# Altium project RFFE_Controller.PrjPcb
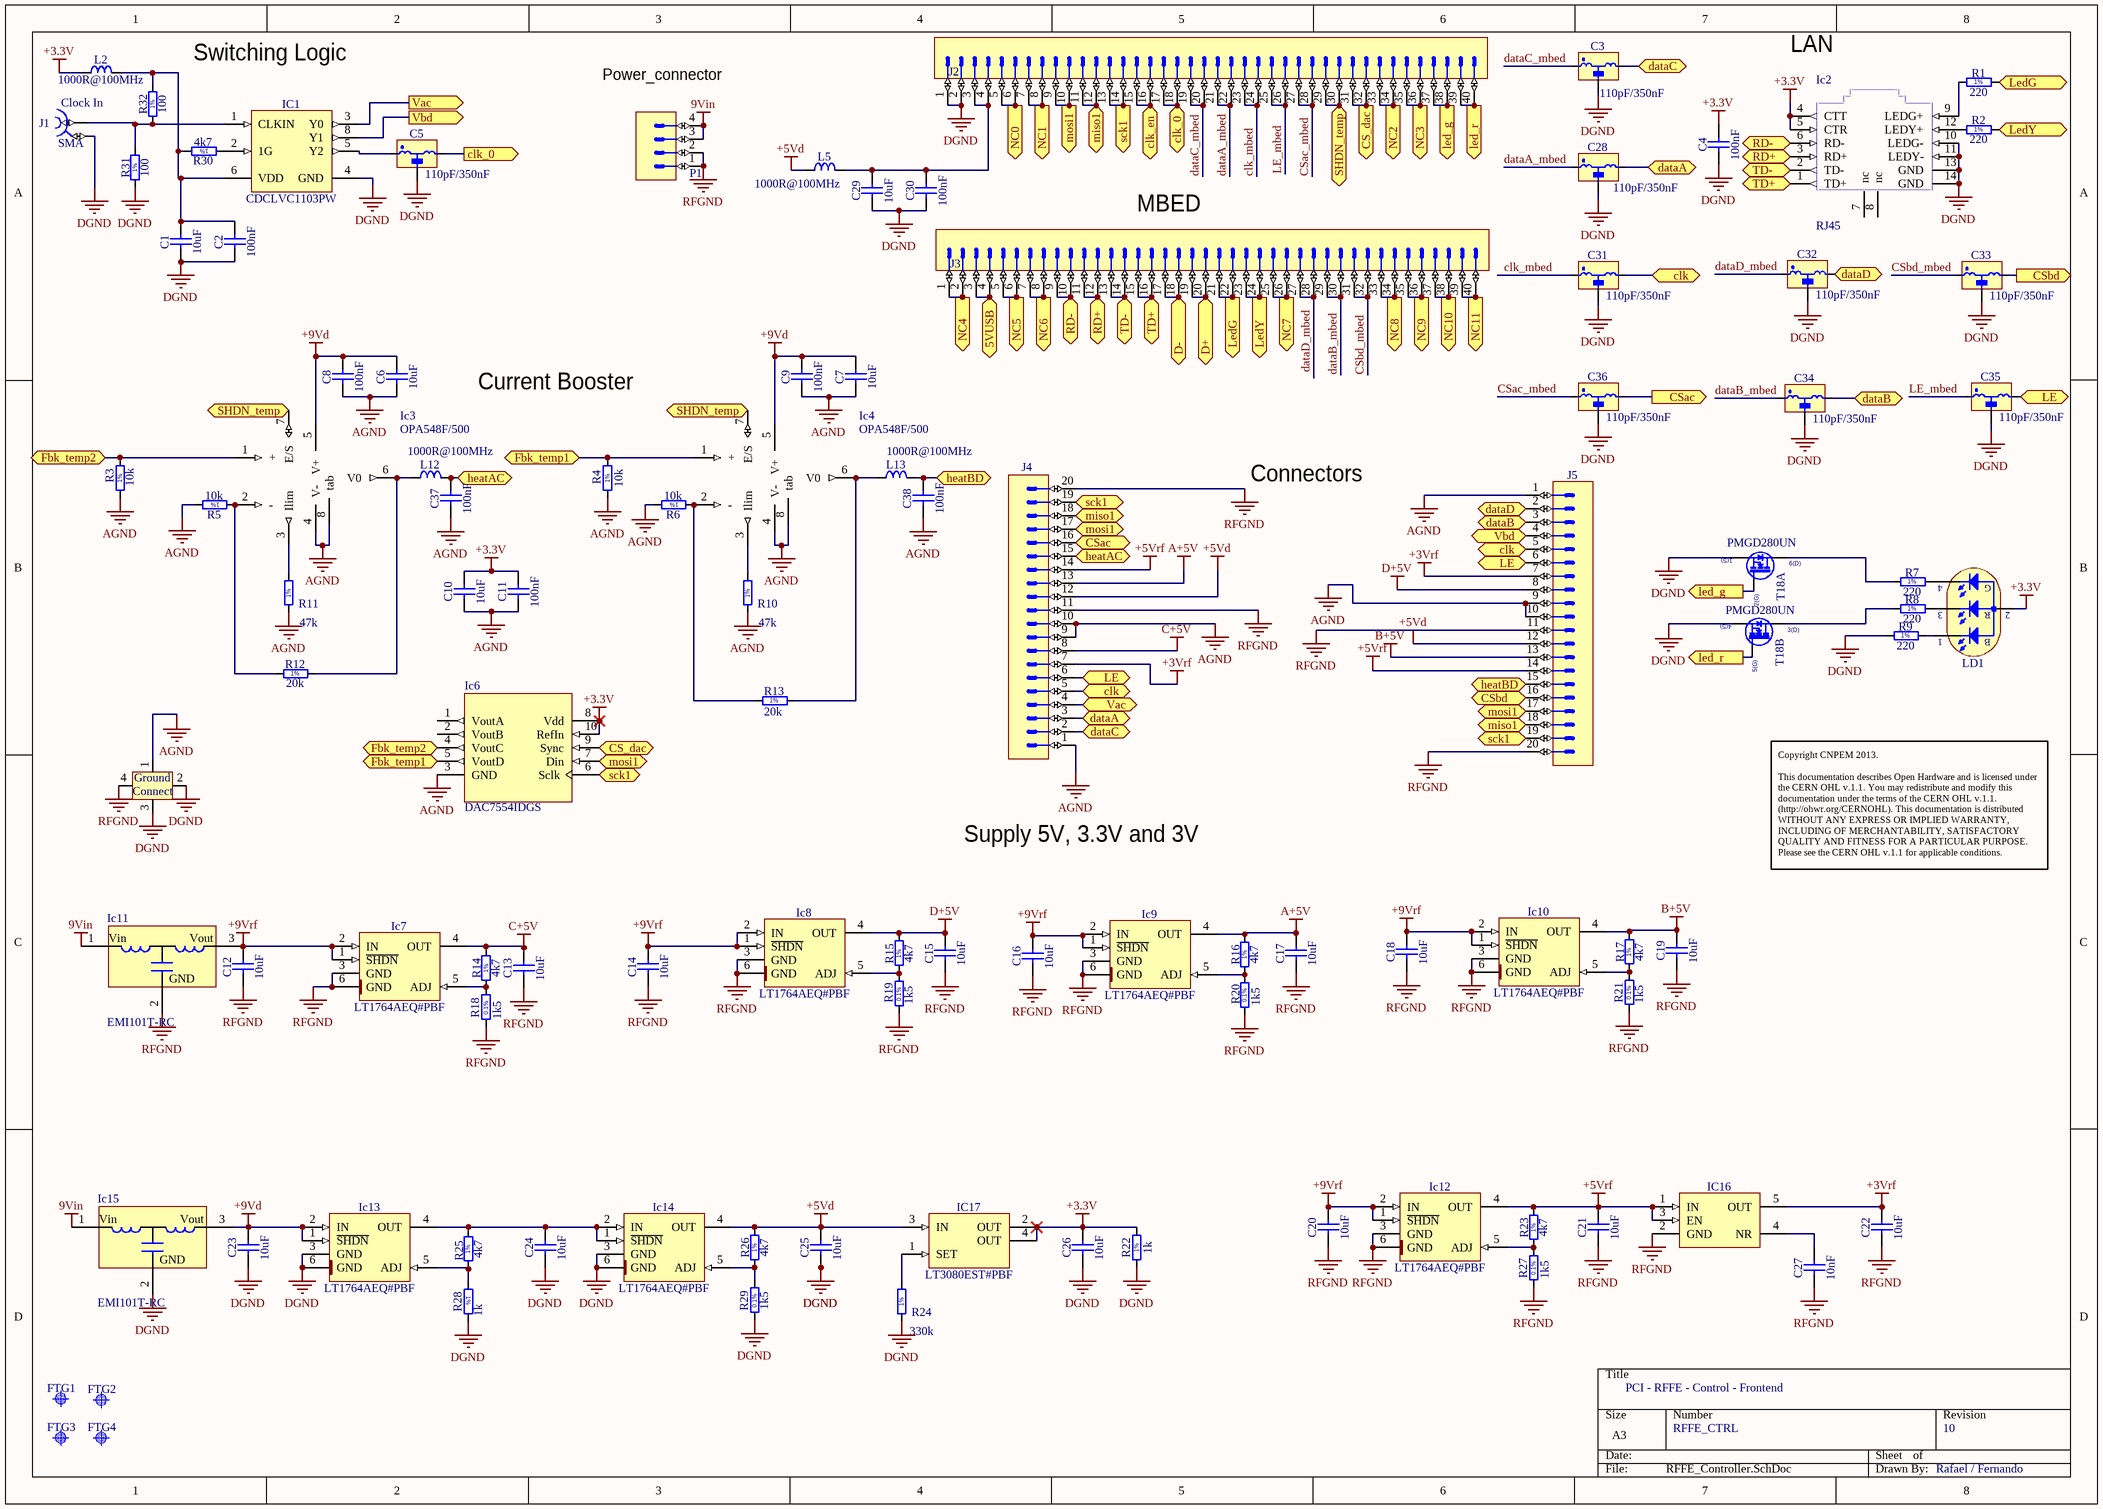
[diagram p0: RFFE_Controller.SchDoc]
1 sheet, 103 parts. Net scope: flat (ports and power ports of the same name join across sheets).
Board file: RFFE_Controller.PcbDoc

## Sheet RFFE_Controller.SchDoc
size A3

### Parts
C1  10uF  [CAPC3216X180N]
C2  100nF  [CAPC1608X87N]
C3  110pF/350nF  [CAPC_MURATA_NFL18ST]
C4  100nF  [CAPC1608X87N]
C5  110pF/350nF  [CAPC_MURATA_NFL18ST]
C6  10uF  [CAPC3216X180N]
C7  10uF  [CAPC3216X180N]
C8  100nF  [CAPC1608X87N]
C9  100nF  [CAPC1608X87N]
C10  10uF  [CAPC3216X180N]
C11  100nF  [CAPC1608X87N]
C12  10uF  [CAPC3216X180N]
C13  10uF  [CAPC3216X180N]
C14  10uF  [CAPC3216X180N]
C15  10uF  [CAPC3216X180N]
C16  10uF  [CAPC3216X180N]
C17  10uF  [CAPC3216X180N]
C18  10uF  [CAPC3216X180N]
C19  10uF  [CAPC3216X180N]
C20  10uF  [CAPC3216X180N]
C21  10uF  [CAPC3216X180N]
C22  10uF  [CAPC3216X180N]
C23  10uF  [CAPC3216X180N]
C24  10uF  [CAPC3216X180N]
C25  10uF  [CAPC3216X180N]
C26  10uF  [CAPC3216X180N]
C27  10nF  [CAPC2012X135N]
C28  110pF/350nF  [CAPC_MURATA_NFL18ST]
C29  10uF  [CAPC3216X180N]
C30  100nF  [CAPC1608X87N]
C31  110pF/350nF  [CAPC_MURATA_NFL18ST]
C32  110pF/350nF  [CAPC_MURATA_NFL18ST]
C33  110pF/350nF  [CAPC_MURATA_NFL18ST]
C34  110pF/350nF  [CAPC_MURATA_NFL18ST]
C35  110pF/350nF  [CAPC_MURATA_NFL18ST]
C36  110pF/350nF  [CAPC_MURATA_NFL18ST]
C37  100nF  [CAPC1608X87N]
C38  100nF  [CAPC1608X87N]
FTG1  Use only in PCB  [FIDUCIAL_TOP_S100-200]  (value not drawn)
FTG2  Use only in PCB  [FIDUCIAL_TOP_S100-200]  (value not drawn)
FTG3  Use only in PCB  [FIDUCIAL_TOP_S100-200]  (value not drawn)
FTG4  Use only in PCB  [FIDUCIAL_TOP_S100-200]  (value not drawn)
IC1  CDCLVC1103PW  [SOP65P640X120-8N]
Ic2  RJ45  [J0006D21BNL]
Ic3  Supplier Part Number 1: OPA548F/500  [TO-263-7-D2PAK-7]  (hidden comment: OPA548FKTWT)
Ic4  Supplier Part Number 1: OPA548F/500  [TO-263-7-D2PAK-7]  (hidden comment: OPA548FKTWT)
Ic6  DAC7554IDGS
Ic7  LT1764AEQ#PBF  [TO170P1394X457-6N-R900X1060]
Ic8  LT1764AEQ#PBF  [TO170P1394X457-6N-R900X1060]
Ic9  LT1764AEQ#PBF  [TO170P1394X457-6N-R900X1060]
Ic10  LT1764AEQ#PBF  [TO170P1394X457-6N-R900X1060]
Ic11  EMI101T-RC  [Filter_EMI_Radial-3]
Ic12  LT1764AEQ#PBF  [TO170P1394X457-6N-R900X1060]
Ic13  LT1764AEQ#PBF  [TO170P1394X457-6N-R900X1060]
Ic14  LT1764AEQ#PBF  [TO170P1394X457-6N-R900X1060]
Ic15  EMI101T-RC  [Filter_EMI_Radial-3]
IC16  TPS73030DBVT  [SOT95P280X145-5N]  (value not drawn)
IC17  LT3080EST#PBF  [SOT230P700X180-4N]
J1  SMA  [JOHNSON_142-0701-873]
J2  (no value)  [TYCO_2-534998-0]
J3  (no value)  [TYCO_2-534998-0]
J4  Header 20  [SAMTEC_TFM-120-01-L-S-RA]  (value not drawn)
J5  Header 20  [SAMTEC_TFM-120-01-L-S-RA]  (value not drawn)
L2  1000R@100MHz  [INDC1608X95N]
L5  1000R@100MHz  [INDC1608X95N]
L12  1000R@100MHz  [INDC1608X95N]
L13  1000R@100MHz  [INDC1608X95N]
LD1  Blue/Red/Green  [LED_AVAGO_HSMF-C113]  (value not drawn)
NT1  Net Tie X 4 and hole 2.2  [Net Tie X 4 and hole 2.2]  (value not drawn)  (net tie, no BOM)
P1  Header 4  [JST_B4B-XH-A(LF)(SN)]  (value not drawn)
R1  220  [RESC2012X60N]
R2  220  [RESC2012X60N]
R3  10k  [RESC2012X60N]
R4  10k  [RESC2012X60N]
R5  10k  [RESC2012X60N]
R6  10k  [RESC2012X60N]
R7  220  [RESC2012X60N]
R8  220  [RESC2012X60N]
R9  220  [RESC2012X60N]
R10  47k  [RESC1608X55N]
R11  47k  [RESC1608X55N]
R12  20k  [RESC1608X55N]
R13  20k  [RESC1608X55N]
R14  4k7  [RESC1608X55N]
R15  4k7  [RESC1608X55N]
R16  4k7  [RESC1608X55N]
R17  4k7  [RESC1608X55N]
R18  1k5  [RESC2012X60N]
R19  1k5  [RESC2012X60N]
R20  1k5  [RESC2012X60N]
R21  1k5  [RESC2012X60N]
R22  1k  [RESC1608X55N]
R23  4k7  [RESC1608X55N]
R24  330k  [RESC2012X60N]
R25  4k7  [RESC1608X55N]
R26  4k7  [RESC1608X55N]
R27  1k5  [RESC2012X60N]
R28  1k  [RESC1608X55N]
R29  1k5  [RESC2012X60N]
R30  4k7  [RESC1608X55N]
R31  100  [RESC1608X55N]
R32  100  [RESC1608X55N]
T18  PMGD280UN  [SOT65P210X110-6N]  (parts A,B of 2)

### Ports
5VUSB, clk, clk_0, clk_0 (out), clk_en, CS_dac (in), CS_dac (out), CSac, CSac (out), CSbd, CSbd (out), D+ (bidir), D- (bidir), dataA, dataB, dataC, dataD, Fbk_temp1, Fbk_temp2, heatAC, heatBD, LE, led_g (out), led_r (out), LedG, LedG (out), LedY, LedY (out), miso1, miso1 (out), mosi1, mosi1 (out), NC0 (out), NC1 (out), NC2 (out), NC3 (out), NC4 (out), NC5 (out), NC6 (out), NC7 (out), NC8 (out), NC9 (out), NC10 (out), NC11 (out), RD+, RD-, sck1, sck1 (out), SHDN_temp, TD+, TD-, Vac, Vac (out), Vbd, Vbd (out)

### Nets
9Vin: Ic11.1(Vin) Ic15.1(Vin) P1.3 P1.4
+3.3V: C4.2 C10.2 C11.2 C26.2 Ic2.4(CTT) Ic2.5(CTR) Ic6.8(Vdd) Ic6.10(RefIn) IC17.2(OUT) IC17.4(OUT) L2.1 LD1.2(AC) R22.2
+3Vrf: C22.2 IC16.5(OUT) J4.7 J5.7
+5Vd: C25.2 Ic14.4(OUT) IC17.3(IN) J4.12 J5.12 L5.1 R26.2
+5Vrf: C21.2 Ic12.4(OUT) IC16.1(IN) IC16.3(EN) J4.14 J5.14 R23.2
+9Vd: C6.2 C7.2 C8.2 C9.2 C23.2 Ic3.5(V+) Ic4.5(V+) Ic13.1(~{SHDN}) Ic13.2(IN) Ic15.3(Vout)
+9Vrf: C12.2 C14.2 C16.2 C18.2 C20.2 Ic7.1(~{SHDN}) Ic7.2(IN) Ic8.1(~{SHDN}) Ic8.2(IN) Ic9.1(~{SHDN}) Ic9.2(IN) Ic10.1(~{SHDN}) Ic10.2(IN) Ic11.3(Vout) Ic12.1(~{SHDN}) Ic12.2(IN)
A+5V: C17.2 Ic9.4(OUT) J4.13 R16.2
AGND: C6.1 C7.1 C8.1 C9.1 C10.1 C11.1 C37.1 C38.1 Ic3.4(V-) Ic3.8(tab) Ic4.4(V-) Ic4.8(tab) Ic6.3(GND) J4.1 J4.9 J4.10 J5.1 J5.9 J5.10 NT1.1 R3.1 R4.1 R5.2 R6.2 R10.1 R11.1
B+5V: C19.2 Ic10.4(OUT) J5.13 R17.2
C+5V: C13.2 Ic7.4(OUT) J4.8 R14.2
D+5V: C15.2 Ic8.4(OUT) J5.8 R15.2
DGND: C1.1 C2.1 C3.2 C4.1 C5.2 C23.1 C24.1 C25.1 C26.1 C28.2 C29.1 C30.1 C31.2 C32.2 C33.2 C34.2 C35.2 C36.2 IC1.4(GND) Ic2.10(LEDG-) Ic2.11(LEDY-) Ic2.13(GND) Ic2.14(GND) Ic13.3(GND) Ic13.6(GND) Ic14.3(GND) Ic14.6(GND) Ic15.2(GND) J1.2 J2.1 J2.2 NT1.2 NT1.3 R9.1 R22.1 R24.1 R28.2 R29.1 R31.1 T18.1(S) T18.4(S)
RFGND: C12.1 C13.1 C14.1 C15.1 C16.1 C17.1 C18.1 C19.1 C20.1 C21.1 C22.1 C27.1 Ic7.3(GND) Ic7.6(GND) Ic8.3(GND) Ic8.6(GND) Ic9.3(GND) Ic9.6(GND) Ic10.3(GND) Ic10.6(GND) Ic11.2(GND) Ic12.3(GND) Ic12.6(GND) IC16.2(GND) J4.11 J4.20 J5.11 J5.20 NT1.4 P1.1 P1.2 R18.1 R19.1 R20.1 R21.1 R27.1
clk_mbed: C31.1 J2.23 J2.24
CSac_mbed: C36.1 J2.27 J2.28
CSbd_mbed: C33.1 J3.31 J3.32
dataA_mbed: C28.1 J2.21 J2.22
dataB_mbed: C34.1 J3.29 J3.30
dataC_mbed: C3.1 J2.19 J2.20
dataD_mbed: C32.1 J3.27 J3.28
LE_mbed: C35.1 J2.25 J2.26
NetC1_2: C1.2 C2.2 IC1.6(VDD) L2.2 R30.2 R32.2
NetC3_3: C3.3 J4.2 ; port dataC
NetC5_1: C5.1 IC1.5(Y2)
NetC5_3: C5.3 J2.17 J2.18 ; port clk_0
NetC24_2: C24.2 Ic13.4(OUT) Ic14.1(~{SHDN}) Ic14.2(IN) R25.2
NetC27_2: C27.2 IC16.4(NR)
NetC28_3: C28.3 J4.3 ; port dataA
NetC29_2: C29.2 C30.2 J2.3 J2.4 L5.2
NetC31_3: C31.3 J4.5 J5.5 ; port clk
NetC32_3: C32.3 J5.2 ; port dataD
NetC33_3: C33.3 J5.16 ; port CSbd
NetC34_3: C34.3 J5.3 ; port dataB
NetC35_3: C35.3 J4.6 J5.6 ; port LE
NetC36_3: C36.3 J4.16 ; port CSac
NetC37_2: C37.2 J4.15 L12.2 ; port heatAC
NetC38_2: C38.2 J5.15 L13.2 ; port heatBD
NetIC1_1: IC1.1(CLKIN) J1.1 R31.2 R32.1
NetIC1_2: IC1.2(1G) R30.1
NetIC1_3: IC1.3(Y0) J4.4 ; port Vac
NetIC1_8: IC1.8(Y1) J5.4 ; port Vbd
NetIc2_1: Ic2.1(TD+) J3.15 J3.16 ; port TD+
NetIc2_2: Ic2.2(TD-) J3.13 J3.14 ; port TD-
NetIc2_3: Ic2.3(RD+) J3.11 J3.12 ; port RD+
NetIc2_6: Ic2.6(RD-) J3.9 J3.10 ; port RD-
NetIc2_9: Ic2.9(LEDG+) R1.1
NetIc2_12: Ic2.12(LEDY+) R2.1
NetIc3_1: Ic3.1(+) Ic6.4(VoutC) R3.2 ; port Fbk_temp2
NetIc3_2: Ic3.2(-) R5.1 R12.1
NetIc3_3: Ic3.3(Ilim) R11.2
NetIc3_6: Ic3.6(V0) L12.1 R12.2
NetIc3_7: Ic3.7(E/S) Ic4.7(E/S) J2.29 J2.30 ; port SHDN_temp
NetIc4_1: Ic4.1(+) Ic6.5(VoutD) R4.2 ; port Fbk_temp1
NetIc4_2: Ic4.2(-) R6.1 R13.1
NetIc4_3: Ic4.3(Ilim) R10.2
NetIc4_6: Ic4.6(V0) L13.1 R13.2
NetIc6_6: Ic6.6(Sclk) J2.13 J2.14 J4.19 J5.19 ; port sck1
NetIc6_7: Ic6.7(Din) J2.9 J2.10 J4.17 J5.17 ; port mosi1
NetIc6_9: Ic6.9(Sync) J2.31 J2.32 ; port CS_dac
NetIc7_5: Ic7.5(ADJ) R14.1 R18.2
NetIc8_5: Ic8.5(ADJ) R15.1 R19.2
NetIc9_5: Ic9.5(ADJ) R16.1 R20.2
NetIc10_5: Ic10.5(ADJ) R17.1 R21.2
NetIc12_5: Ic12.5(ADJ) R23.1 R27.2
NetIc13_5: Ic13.5(ADJ) R25.1 R28.1
NetIc14_5: Ic14.5(ADJ) R26.1 R29.2
NetIC17_1: IC17.1(SET) R24.2
NetJ2_5: J2.5 J2.6 ; port NC0
NetJ2_7: J2.7 J2.8 ; port NC1
NetJ2_11: J2.11 J2.12 J4.18 J5.18 ; port miso1
NetJ2_15: J2.15 J2.16 ; port clk_en
NetJ2_33: J2.33 J2.34 ; port NC2
NetJ2_35: J2.35 J2.36 ; port NC3
NetJ2_37: J2.37 J2.38 T18.2(G) ; port led_g
NetJ2_39: J2.39 J2.40 T18.5(G) ; port led_r
NetJ3_1: J3.1 J3.2 ; port NC4
NetJ3_3: J3.3 J3.4 ; port 5VUSB
NetJ3_5: J3.5 J3.6 ; port NC5
NetJ3_7: J3.7 J3.8 ; port NC6
NetJ3_17: J3.17 J3.18 ; port D-
NetJ3_19: J3.19 J3.20 ; port D+
NetJ3_21: J3.21 J3.22 R1.2 ; port LedG
NetJ3_23: J3.23 J3.24 R2.2 ; port LedY
NetJ3_25: J3.25 J3.26 ; port NC7
NetJ3_33: J3.33 J3.34 ; port NC8
NetJ3_35: J3.35 J3.36 ; port NC9
NetJ3_37: J3.37 J3.38 ; port NC10
NetJ3_39: J3.39 J3.40 ; port NC11
NetLD1_1: LD1.1(CB) R9.2
NetLD1_3: LD1.3(CR) R8.2
NetLD1_4: LD1.4(CG) R7.2
NetR7_1: R7.1 T18.6(D)
NetR8_1: R8.1 T18.3(D)

Not connected (* = marked no-connect by the designer): Ic2 7(nc) 8(nc); Ic6 1(VoutA) 2(VoutB)

### Notes on the sheet
- (near J1) Clock In
- Switching Logic
- (near P1) Power_connector
- LAN
- (near J3) MBED
- Current Booster
- Connectors
- Supply 5V, 3.3V and 3V
- Copyright CNPEM 2013.
  This documentation describes Open Hardware and is licensed under the CERN OHL v.1.1. You may redistribute and modify this documentation under the terms of the CERN OHL v.1.1. (http://ohwr.org/CERNOHL). This documentation is distributed WITHOUT ANY EXPRESS OR IMPLIED WARRANTY, INCLUDING OF MERCHANTABILITY, SATISFACTORY QUALITY AND FITNESS FOR A PARTICULAR PURPOSE. Please see the CERN OHL v.1.1 for applicable conditions.
- PCI - RFFE - Control - Frontend
- RFFE_CTRL
- 10
- Rafael / Fernando
- (in symbol LED_AVAGO_HSMF-C113) G; R; B
- (in symbol Net Tie X 4 and hole 2.2) Ground; Connect
- (in symbol PMGD280UN, part A) 6(D); 1(S); 2(G)
- (in symbol PMGD280UN, part B) 3(D); 4(S); 5(G)
- (in symbol R0603_1K_1%_0.1W_100PPM) 1%
- (in symbol R0603_4K7_1%_0.1W_100PPM) 1%
- (in symbol R0603_20K_1%_0.1W_100PPM) 1%
- (in symbol R0603_47K_1%_0.1W_100PPM) 1%
- (in symbol R0603_100R_1%_0.1W_100PPM) 1%
- (in symbol R0805_1K5_0.1%_0.1W_10PPM) 0.1%
- (in symbol R0805_10K_1%_0.125W_100PPM) 1%
- (in symbol R0805_220R_1%_0.125W_100PPM) 1%
- (in symbol R0805_330K_1%_0.125W_100PPM) 1%

### Library data of the parts
C1 C6 C7 C10 C12-C26 C29 = CC1206_10UF_25V_10%_X7R: Non-polarised capacitor; Manufacturer: GENERIC; Part Description: SMD Multilayer Chip Ceramic Capacitor; Manufacturer1 Part Number: C1206C106K4RACTU; Tolerance: ±10%; Voltage: 25V; TC: X7R; Manufacturer Part Number: CC1206_10uF_25V_10%_X7R; Part Number: CC1206_10UF_25V_10%_X7R; Component Kind: Standard; Component Type: Standard; Pin Count: 2; Value: 10uF; Status: Preferred; Case: 1206; Mounted: Yes; Socket: No; SMD: Yes; Sense: No; Manufacturer1 Example: KEMET; Manufacturer1 ComponentHeight: 1.8mm; HelpURL: \\cern.ch\dfs\Applications\Altium\Datasheets\CC1206_X7R_KEMET.pdf; Author: CERN DEM JLC; CreateDate: 12/09/2012; LatestRevisionDate: 12/09/2012
C2 C4 C8 C9 C11 C30 C37 C38 = CC0603_100NF_50V_10%_X7R: Non-polarised capacitor; Manufacturer: GENERIC; Part Description: SMD Multilayer Chip Ceramic Capacitor; Manufacturer1 Part Number: 223858615649; Tolerance: ±10%; Voltage: 50V; TC: X7R; Manufacturer Part Number: CC0603_100NF_50V_10%_X7R; Part Number: CC0603_100NF_50V_10%_X7R; Component Kind: Standard; Component Type: Standard; Pin Count: 2; Value: 100nF; Status: Preferred; Case: 0603; Mounted: Yes; Socket: No; SMD: Yes; Sense: No; Manufacturer1 Example: PHYCOMP; Manufacturer1 ComponentHeight: 0.87mm; HelpURL: \\cern.ch\dfs\Applications\Altium\Datasheets\CC0603_X7R_PHYCOMP.pdf; Author: CERN DEM JLC; CreateDate: 03/12/2007; LatestRevisionDate: 03/12/2007
C3 C5 C28 C31-C36 = CEMIF_110PF/350NF_50V_MURATA_NFL18ST506H1A3D: EMI Filter (LC Combined); Part Description: Chip EMIFIL® LC Combined Monolithic, NFL18ST Series; Manufacturer: MURATA; Voltage: 10V; Tolerance: +50%-20%; Part Number: CEMIF_110PF/350NF_50V_MURATA_NFL18ST506H1A3D; Component Kind: Standard; Component Type: Standard; Pin Count: 2; Value: 110pF/350nF; Status: None; Manufacturer Part Number: NFL18ST506H1A3D; Case: 0603; Mounted: Yes; Socket: No; SMD: Yes; Sense: No; ComponentHeight: 0.7mm; HelpURL: \\cern.ch\dfs\Applications\Altium\Datasheets\CEMIF_MURATA_NFL18ST.pdf; Author: CERN DEM JLC; CreateDate: 18/11/2014; LatestRevisionDate: 18/11/2014
C27 = CC0805_10NF_50V_5%_C0G: Non-polarised capacitor; Manufacturer: GENERIC; Part Description: SMD Multilayer Chip Ceramic Capacitor; Manufacturer1 Part Number: C0805C103J5GACTU; Tolerance: ±5%; Voltage: 50V; TC: C0G/NP0; Manufacturer Part Number: CC0805_10NF_50V_5%_C0G; Part Number: CC0805_10NF_50V_5%_C0G; Component Kind: Standard; Component Type: Standard; Pin Count: 2; Value: 10nF; Status: None; Case: 0805; Mounted: Yes; Socket: No; SMD: Yes; Sense: No; Manufacturer1 Example: KEMET; Manufacturer1 ComponentHeight: 0.88mm; HelpURL: \\cern.ch\dfs\Applications\Altium\Datasheets\CC0805_C0G_KEMET_(Commercial Grade).pdf; Author: CERN DEM JLC; CreateDate: 02/02/2011; LatestRevisionDate: 22/04/2015
FTG1-FTG4 = FIDUCIAL_TARGET_S100-200: Fiducial Target; Part Description: Square Fiducial Target, Top Layer, 1.0mm, Top Solder 2.0mm, Keepout =2.0mm; Mounted: No; Part Number: FIDUCIAL_TARGET_S100-200; Component Kind: Standard (No BOM); Component Type: Standard (No BOM); Pin Count: 1; Family: Fiducial; Socket: No; SMD: Yes; Sense: No; Status: None; ComponentHeight: 0mm; HelpURL: Undefined; Author: CERN DEM JLC; CreateDate: 09/02/2010; LatestRevisionDate: 04/04/2012; PackageDescription: Square Fiducial Target, Top Layer, 1.0mm, Top Solder 2.0mm, Keepout =2.0mm
IC1 = CDCLVC1103PW: 3.3 V and 2.5 V LVCMOS 1:3 High-Performance Clock Buffer; Manufacturer: TEXAS INSTRUMENTS; PressFit: No; Bonding: No; Part Number: CDCLVC1103PW; Component Kind: Standard; Component Type: Standard; Device: CDCLVC1103PW; PackageDescription: SOP, 0.65mm pitch; 8 pin, 4.40mm W X 3.00mm L X 1.20mm H body, IPC Medium Density; Part Description: 3.3 V and 2.5 V LVCMOS 1:3 High-Performance Clock Buffer; Manufacturer Part Number: CDCLVC1103PW; Pin Count: 8; Case: TSSOP8; Mounted: Yes; Socket: No; SMD: Yes; Sense: No; ComponentHeight: 1.2mm; HelpURL: \\cern.ch\dfs\Applications\Altium\Datasheets\CDCLVC1103PW.pdf; Author: CERN DEM JMW; CreateDate: 06/09/2011; LatestRevisionDate: 06/09/2011
Ic2 = J0006D21BNL: CONN MAGJACK 1PORT 100 BASE-TX; Manufacturer: Pulse Electronics Corporation; Part Description: 1 Port, 1x1 Tab-Down 10/100BASE-TX RJ45 FastJack Connector Module With LEDs Y/G; Number of Ports: 1; LED Color: Green - Yellow; Number of Cores per Jack: 4; Shielding: Shielded; Tab Direction: Down; Shield Material: Brass; PressFit: No; Supplier 1: Digi-Key; Manufacturer Part Number: J0006D21BNL; RoHS: RoHS Compliant; Category: Connectors, Interconnects; Stock 1: 1565; Pricing 1: 1=6.38, 25=5.586, 50=5.32, 100=5.054, 250=4.522, 500=4.256, 1000=3.724, 2500=3.5378, 5000=3.458 (USD); Packaging: Bulk; Connector Type: RJ45; Number of Rows: 1; Applications: 10/100 Base-TX, AutoMDIX; Mounting Type: Through Hole; Orientation: 90° Angle (Right); Termination: Solder; Height Above Board: 0.545" (13.84mm); Features: Board Guide; Contact Material: Phosphor Bronze; Contact Finish: Gold; Contact Finish Thickness: 15µin (0.38µm); Housing Material: Thermoplastic; Operating Temperature: 0°C ~ 70°C; ComponentLink1URL: http://productfinder.pulseeng.com/products/datasheets/J403.pdf; ComponentLink1Description: http://productfinder.pulseeng.com/products/datasheets/J403.pdf; Supplier Part Number 1: J0006D21BNL; Part Number: J0006D21BNL; Component Kind: Standard; Component Type: Standard; Pin Count: 16; Family: RJ45; Mounted: Yes; Socket: No; SMD: No; Sense: No; Status: None; ComponentHeight: 13.84mm; HelpURL: http://productfinder.pulseeng.com/products/datasheets/J403.pdf; Author: LNLS DIG FCS; CreateDate: 28/06/2016; LatestRevisionDate: 28/06/2016
Ic3 Ic4 = OPA548FKTWT: IC OPAMP PWR 1MHZ SGL D2PAK-7; Manufacturer: TEXAS INSTRUMENTS; Amplifier Type: Power; Number of Circuits: 1; Slew Rate: 10 V/µs; Current - Input Bias: 100nA; Voltage - Input Offset: 2mV; Current - Supply: 17mA; Current - Output / Channel: 5A; Voltage - Supply, Single/Dual (±): 8 V ~ 60 V, ±4 V ~ 30 V; PressFit: No; Bonding: No; Supplier 1: Digi-Key; Manufacturer Part Number: OPA548FKTWT; RoHS: RoHS Compliant; Category: Integrated Circuits (ICs); Stock 1: 1164; Pricing 1: 1=16.22, 10=14.721, 25=13.6488 (USD); Packaging: Digi-Reel®; Output Type: -; Gain Bandwidth Product: 1MHz; -3db Bandwidth: -; Operating Temperature: -40°C ~ 85°C; Mounting Type: Surface Mount; Package / Case: TO-263-8, D²Pak (7 Leads + Tab), TO-263CA; Supplier Device Package: DDPAK/TO-263-7; ComponentLink1URL: http://www.ti.com/lit/ds/symlink/opa548.pdf; ComponentLink1Description: http://www.ti.com/lit/ds/symlink/opa548.pdf; Part Number: OPA548FKTWT; Component Kind: Standard; Component Type: Standard; Device: OPA548FKTWT; PackageDescription: TO-263 7 Leads - SMD - D2PAK-7; Part Description: IC OPAMP PWR 1MHZ SGL D2PAK-7; Pin Count: 7; Case: TO-263-7; Mounted: Yes; Socket: No; SMD: Yes; Sense: No; ComponentHeight: 5.00mm; Author: LNLS DIG FCS; HelpURL: http://www.ti.com/lit/ds/symlink/opa548.pdf; CreateDate: 30/06/2016; LatestRevisionDate: 30/06/2016
Ic6 = DAC7554IDGS: Manufacturer: Texas Instruments; Settling Time: 5µs; Number of Bits: 12; Data Interface: Serial, SPI™; Number of Converters: 4; Voltage Supply Source: Single Supply; Power Dissipation (Max): 3.5mW; Number of Outputs and Type: 4 Voltage, Unipolar; DAC7554: 296-17551-5-ND; Supplier 1: Digi-Key; RoHS: RoHS Compliant; Category: Integrated Circuits (ICs); Stock 1: 1057; Pricing 1: 1=11.48, 10=10.44, 100=7.047, 250=6.91652, 500=6.786, 750=6.65551, 1000=6.525 (USD); Packaging: Tube; Operating Temperature: -40°C ~ 105°C; Mounting Type: Surface Mount; Package / Case: 10-TFSOP, 10-MSOP (0.118", 3.00mm Width); Supplier Device Package: 10-MSOP; Sampling Rate (Per Second): *; ComponentLink1URL: http://www.ti.com/lit/ds/symlink/dac7554.pdf; ComponentLink1Description: http://www.ti.com/lit/ds/symlink/dac7554.pdf; Supplier 2: Farnell; Pricing: 1=12.62, 10=10.51, 100=6.88, 250=6.56, 500=6.43 (GBP); Stock: 63
Ic7-Ic10 Ic12-Ic14 = LT1764AEQ#PBF: 3A, Fast Transient Response, Low Noise, LDO Regulators; Manufacturer: LINEAR TECHNOLOGY; Part Description: 2.5V 3A, Fast Transient Response, Low Noise, LDO Regulators; PressFit: No; Bonding: No; Manufacturer Part Number: LT1764AEQ#PBF; Part Number: LT1764AEQ#PBF; Component Kind: Standard; Component Type: Standard; Device: LT1764AEQ#PBF; PackageDescription: TO, 1.70mm Pitch; 5 Pin, 13.945mm L X 8.89mm W X 4.572mm H body, IPC Medium Density; Pin Count: 6; Case: TO-263; Mounted: Yes; Socket: No; SMD: Yes; Sense: No; ComponentHeight: 4.57mm; Author: LNLS DIG GBMB; CreateDate: 17/02/2017; LatestRevisionDate: 17/02/2017
Ic11 Ic15 = EMI101T-RC: FILTER EMI 100PF 350-500MHZ 5A; Manufacturer: Bourns Inc.; Part Description: LC (T-Type) Low Pass Filter 1 Channel 5A 25dB @ 350MHz ~ 500MHz Radial - 3 Leads; Number of Channels: 1; Attenuation Value: 25dB @ 350MHz ~ 500MHz; Resistance - Channel (Ohms): 0.05; Values: C = 100pF; ESD Protection: No; Filter Order: 3rd; PressFit: No; Supplier 1: Digi-Key; RoHS: Vendor undefined; Category: Filters; Stock 1: 15905; Pricing 1: 1=0.27, 10=0.255, 25=0.2428, 50=0.2352, 100=0.2273, 250=0.21552, 500=0.18026, 1000=0.1399 (USD); Packaging: Cut Tape (CT); Type: Low Pass; Package / Case: Radial - 3 Leads; Size / Dimension: 0.354" L x 0.126" W (9.00mm x 3.20mm); Operating Temperature: -25°C ~ 85°C; ComponentLink1URL: http://www.bourns.com/data/global/pdfs/emi_t_series.pdf; ComponentLink1Description: http://www.bourns.com/data/global/pdfs/emi_t_series.pdf; Supplier Part Number 1: EMI_Filter; Manufacturer Part Number: EMI101T-RC; Technology: LC (T-Type); Center / Cutoff Frequency: -; Current: 5A; Applications: General Purpose; Height: 0.315" (8.00mm); Part Number: EMI101T-RC; Component Kind: Standard; Component Type: Standard; Device: EMI101T-RC; PackageDescription: 3 Leads In-Line Package, Pitch 2.54mm; Pin Count: 3; Case: Radial - 3 Leads; Mounted: Yes; Socket: Yes; SMD: No; Sense: No; Bonding: No; ComponentHeight: 8mm; Author: LNLS DIG FCS; HelpURL: http://www.bourns.com/docs/Product-Datasheets/emi_t_series.pdf; CreateDate: 04/07/2016; LatestRevisionDate: 04/07/2016
IC16 = TPS73030DBVT: Single Output LDO, 200mA, Fixed (3.3V), High PSRR, Low Noise; Part Description: Single Output LDO, 200mA, Fixed (3.0V), High PSRR, Low Noise Linear Regulator; Manufacturer: TEXAS INSTRUMENTS; PressFit: No; Bonding: No; Part Number: TPS73030DBVT; Component Kind: Standard; Component Type: Standard; Device: TPS73030DBVT; PackageDescription: SOT, 0.95mm pitch; 5 pin, 1.60mm W X 2.90mm L X 1.45mm H body, IPC Medium Density; Manufacturer Part Number: TPS73030DBVT; Pin Count: 5; Case: SOT23-5; Mounted: Yes; Socket: No; SMD: Yes; Sense: No; ComponentHeight: 1.45mm; HelpURL: http://www.ti.com/lit/ds/symlink/tps730.pdf; Author: LNLS DIG FCS; CreateDate: 01/07/2016; LatestRevisionDate: 06/09/2017
IC17 = LT3080EST#PBF: 200mA, Programmable Current Source; Part Description: 0 To 36V Adjustable 1.1A Single Resistor Low Dropout Regulator; Manufacturer: LINEAR TECHNOLOGY; PressFit: No; Bonding: No; Part Number: LT3080EST#PBF; Component Kind: Standard; Component Type: Standard; Device: LT3080EST#PBF; PackageDescription: SOT223, 2.30mm pitch; 3 pin, 3.70mm W X 6.70mm L, IPC Medium Density; Manufacturer Part Number: LT3080EST#PBF; Pin Count: 4; Case: SOT223; Mounted: Yes; Socket: No; SMD: Yes; Sense: No; ComponentHeight: 1.8mm; HelpURL: http://cds.linear.com/docs/en/datasheet/3080fc.pdf; Author: LNLS DIG FCS; CreateDate: 04/07/2016; LatestRevisionDate: 04/07/2016
J1 = JOHNSON_142-0701-873: Part Description: SMA End Launch Straight Bulkhead Jack Receptacle - Round Contact; PressFit: No; Part Number: JOHNSON_142-0701-873; Component Kind: Standard; Component Type: Standard; Pin Count: 2; Family: SMA; Mounted: Yes; Socket: No; SMD: No; Sense: No; Status: None; Manufacturer: JOHNSON; Manufacturer Part Number: 142-0701-873; ComponentHeight: 8.05mm; HelpURL: \\cern.ch\dfs\Applications\Altium\Datasheets\JOHNSON_142-0701-873.pdf; Author: CERN DEM JLC; CreateDate: 11/05/2009; LatestRevisionDate: 11/05/2009
J2 J3 = TYCO_2-534998-0: Connector 40 Male; Part Description: 40 Contacts, Vertical Low Profile IDC Shrouded Header with Ejection Latches; Manufacturer: TYCO ELECTRONICS; PressFit: No; Part Number: TYCO_2-534998-0; Component Kind: Standard; Component Type: Standard; Pin Count: 40; Family: AMP-LATCH; Mounted: Yes; Socket: No; SMD: No; Sense: No; Status: None; Manufacturer Part Number: 2-534998-0; ComponentHeight: 6.22mm; HelpURL: http://www.te.com/commerce/DocumentDelivery/DDEController?Action=srchrtrv&DocNm=534998&DocType=Customer+Drawing&DocLang=English; Author: LNLS DIG FCS; CreateDate: 28/06/2016; LatestRevisionDate: 28/06/2016
J4 J5 = SAMTEC_TFM-120-01-L-S-RA: Connector 20 Male; Manufacturer: SAMTEC; Part Description: 20 Contacts - Pitch 1.27mm - Single Row Right Angle Header; PressFit: No; Manufacturer Part Number: TFM-120-01-L-S-RA; Part Number: SAMTEC_TFM-120-01-L-S-RA; Component Kind: Standard; Component Type: Standard; Pin Count: 20; Family: Header 20; Mounted: Yes; Socket: No; Sense: No; SMD: No; Status: None; ComponentHeight: 4.45mm; HelpURL: http://suddendocs.samtec.com/catalog_english/tfm.pdf; Author: LNLS DIG FCS; CreateDate: 30/06/2016; LatestRevisionDate: 30/06/2016
L2 L5 L12 L13 = IND0603_MURATA_BLM18HE102SN1: Inductor; Part Description: SMD EMIFIL Suppression Chip Ferrite Bead; Manufacturer: MURATA; Power: 600mA; Resistance: 0.35R; Tolerance: ±25%; Part Number: IND0603_MURATA_BLM18HE102SN1; Component Kind: Standard; Component Type: Standard; Pin Count: 2; Value: 1000R@100MHz; Status: None; Manufacturer Part Number: BLM18HE102SN1; Case: 0603; Mounted: Yes; Socket: No; SMD: Yes; Sense: No; ComponentHeight: 0.95mm; HelpURL: \\cern.ch\dfs\Applications\Altium\Datasheets\IND0603_MURATA_BLM18H.pdf; Author: CERN DEM JLC; CreateDate: 09/12/2013; LatestRevisionDate: 09/12/2013
LD1 = LED_AVAGO_HSMF-C113: Tricolor LEDs 1 Cathode Blue, 2 Common Anode, 3 Cathode Red, 4 Cathode Green; Part Description: Right Angle Tricolor (Blue, Red, Green) Surface Mount ChipLED; Manufacturer: AVAGO TECHNOLOGIES; PressFit: No; Bonding: No; Part Number: LED_AVAGO_HSMF-C113; Component Kind: Standard; Component Type: Standard; Color: Blue/Red/Green; PackageDescription: Right Angle Tricolor Surface Mount ChipLED, Body 2.5x1mm; Manufacturer Part Number: HSMF-C113; Pin Count: 4; Mounted: Yes; Socket: No; SMD: Yes; Sense: No; ComponentHeight: 1mm; HelpURL: \\cern.ch\dfs\Applications\Altium\Datasheets\LED_AVAGO_HSMF-C113.pdf; Author: CERN DEM JLC; CreateDate: 29/09/2010; LatestRevisionDate: 29/09/2010
NT1 = Net Tie X 4 and hole 2.2: Part Description: Net Tie (4 Nets) and hole 2.2mm x 7.11mm; Mounted: No; Part Number: Net Tie X 4 and hole 2.2; Component Type: Net Tie; Pin Count: 4; Family: Net Tie; Socket: No; SMD: No; Sense: No; Status: None; ComponentHeight: 0mm; HelpURL: Undefined; Author: LNLS DIG FCS; CreateDate: 01/07/2016; LatestRevisionDate: 01/07/2016; PackageDescription: Plated Through Hole For 4xGND link: Hole Dia.=2.2mm Pad =7.11 x 7.11mm
P1 = JST_B4B-XH-A(LF)(SN): Connector 4 Male; Part Description: 4 Contacts, 2.5mm Pitch, Top Entry Type Shrouded Header; Manufacturer: JST (JAPAN SOLDERLESS TERMINALS); PressFit: No; LatestRevisionDate: 14/08/2014; Part Number: JST_B4B-XH-A(LF)(SN); Component Kind: Standard; Component Type: Standard; Pin Count: 4; Family: Header 4; Mounted: Yes; Socket: No; SMD: No; Sense: No; Status: None; Manufacturer Part Number: B4B-XH-A(LF)(SN); ComponentHeight: 7mm; HelpURL: \\cern.ch\dfs\Applications\Altium\Datasheets\JST_B4B-XH-A(LF)(SN).pdf; Author: CERN DEM JLC; CreateDate: 14/08/2014
R1 R2 R7-R9 = R0805_220R_1%_0.125W_100PPM: Resistor - 1%; Manufacturer: GENERIC; Part Description: General Purpose Thick Film Chip Resistor; Manufacturer1 Part Number: NRC10F2200TRF; Power: 0.125W; TC: ±100ppm/°C; Manufacturer Part Number: R0805_220R_1%_0.125W_100PPM; Tolerance: ±1%; Part Number: R0805_220R_1%_0.125W_100PPM; Component Kind: Standard; Component Type: Standard; Pin Count: 2; Value: 220; Status: Preferred; Case: 0805; Mounted: Yes; Sense: No; Socket: No; SMD: Yes; Manufacturer1 Example: NIC COMPONENT; Manufacturer1 ComponentHeight: 0.6mm; HelpURL: \\cern.ch\dfs\Applications\Altium\Datasheets\R0805_NIC_NRC.pdf; Author: CERN DEM JLC; CreateDate: 03/12/2007; LatestRevisionDate: 13/03/2008
R3-R6 = R0805_10K_1%_0.125W_100PPM: Resistor - 1%; Manufacturer: GENERIC; Part Description: General Purpose Thick Film Chip Resistor; Manufacturer1 Part Number: NRC10F1002TRF; Power: 0.125W; TC: ±100ppm/°C; Manufacturer Part Number: R0805_10K_1%_0.125W_100PPM; Tolerance: ±1%; Part Number: R0805_10K_1%_0.125W_100PPM; Component Kind: Standard; Component Type: Standard; Pin Count: 2; Value: 10k; Status: Preferred; Case: 0805; Mounted: Yes; Sense: No; Socket: No; SMD: Yes; Manufacturer1 Example: NIC COMPONENT; Manufacturer1 ComponentHeight: 0.6mm; HelpURL: \\cern.ch\dfs\Applications\Altium\Datasheets\R0805_NIC_NRC.pdf; Author: CERN DEM JLC; CreateDate: 03/12/2007; LatestRevisionDate: 13/03/2008
R10 R11 = R0603_47K_1%_0.1W_100PPM: Resistor - 1%; Manufacturer: GENERIC; Part Description: General Purpose Thick Film Chip Resistor; Manufacturer1 Part Number: NRC06F4702TRF; Power: 0.1W; TC: ±100ppm/°C; Tolerance: ±1%; Manufacturer Part Number: R0603_47K_1%_0.1W_100PPM; Part Number: R0603_47K_1%_0.1W_100PPM; Component Kind: Standard; Component Type: Standard; Pin Count: 2; Value: 47k; Status: Preferred; Case: 0603; Mounted: Yes; Sense: No; Socket: No; SMD: Yes; Manufacturer1 Example: NIC COMPONENT; Manufacturer1 ComponentHeight: 0.55mm; HelpURL: \\cern.ch\dfs\Applications\Altium\Datasheets\R0603_NIC_NRC.pdf; Author: CERN DEM JLC; CreateDate: 03/12/2007; LatestRevisionDate: 13/03/2008
R12 R13 = R0603_20K_1%_0.1W_100PPM: Resistor - 1%; Manufacturer: GENERIC; Part Description: General Purpose Thick Film Chip Resistor; Manufacturer1 Part Number: NRC06F2002TRF; Power: 0.1W; TC: ±100ppm/°C; Manufacturer Part Number: R0603_20K_1%_0.1W_100PPM; Tolerance: ±1%; Part Number: R0603_20K_1%_0.1W_100PPM; Component Kind: Standard; Component Type: Standard; Pin Count: 2; Value: 20k; Status: Preferred; Case: 0603; Mounted: Yes; Sense: No; Socket: No; SMD: Yes; Manufacturer1 Example: NIC COMPONENT; Manufacturer1 ComponentHeight: 0.55mm; HelpURL: \\cern.ch\dfs\Applications\Altium\Datasheets\R0603_NIC_NRC.pdf; Author: CERN DEM JLC; CreateDate: 03/12/2007; LatestRevisionDate: 13/03/2008
R14-R17 R23 R25 R26 R30 = R0603_4K7_1%_0.1W_100PPM: Resistor - 1%; Manufacturer: GENERIC; Part Description: General Purpose Thick Film Chip Resistor; Manufacturer1 Part Number: NRC06F4701TRF; Power: 0.1W; TC: ±100ppm/°C; Manufacturer Part Number: R0603_4K7_1%_0.1W_100PPM; Tolerance: ±1%; Part Number: R0603_4K7_1%_0.1W_100PPM; Component Kind: Standard; Component Type: Standard; Pin Count: 2; Value: 4k7; Status: Preferred; Case: 0603; Mounted: Yes; Sense: No; Socket: No; SMD: Yes; Manufacturer1 Example: NIC COMPONENT; Manufacturer1 ComponentHeight: 0.55mm; HelpURL: \\cern.ch\dfs\Applications\Altium\Datasheets\R0603_NIC_NRC.pdf; Author: CERN DEM JLC; CreateDate: 03/12/2007; LatestRevisionDate: 13/03/2008
R18-R21 R27 R29 = R0805_1K5_0.1%_0.1W_10PPM: Resistor - 0.1%; Manufacturer: GENERIC; Part Description: Thin Film Chip Resistor; Manufacturer1 Part Number: RN73C2A1K5BTG; Power: 0.1W; TC: ±10ppm; Manufacturer Part Number: R0805_1K5_0.1%_0.1W_10PPM; Tolerance: ±0.1%; Part Number: R0805_1K5_0.1%_0.1W_10PPM; Component Kind: Standard; Component Type: Standard; Pin Count: 2; Value: 1k5; Status: Not recommended; Case: 0805; Mounted: Yes; Sense: No; Socket: No; SMD: Yes; Manufacturer1 Example: TYCO HOLSWORTHY; Manufacturer1 ComponentHeight: 0.6mm; HelpURL: \\cern.ch\dfs\Applications\Altium\Datasheets\R0805_Tyco_RN73.pdf; Author: CERN DEM JLC; CreateDate: 03/12/2007; LatestRevisionDate: 13/03/2008
R22 R28 = R0603_1K_1%_0.1W_100PPM: Resistor - 1%; Manufacturer: GENERIC; Part Description: General Purpose Thick Film Chip Resistor; Manufacturer1 Part Number: NRC06F1001TRF; Power: 0.1W; TC: ±100ppm/°C; Manufacturer Part Number: R0603_1K_1%_0.1W_100PPM; Tolerance: ±1%; Part Number: R0603_1K_1%_0.1W_100PPM; Component Kind: Standard; Component Type: Standard; Pin Count: 2; Value: 1k; Status: Preferred; Case: 0603; Mounted: Yes; Sense: No; Socket: No; SMD: Yes; Manufacturer1 Example: NIC COMPONENT; Manufacturer1 ComponentHeight: 0.55mm; HelpURL: \\cern.ch\dfs\Applications\Altium\Datasheets\R0603_NIC_NRC.pdf; Author: CERN DEM JLC; CreateDate: 03/12/2007; LatestRevisionDate: 13/03/2008
R24 = R0805_330K_1%_0.125W_100PPM: Resistor - 1%; Manufacturer: GENERIC; Part Description: General Purpose Thick Film Chip Resistor; Manufacturer1 Part Number: NRC10F3303TRF; Power: 0.125W; TC: ±100ppm/°C; Manufacturer Part Number: R0805_330K_1%_0.125W_100PPM; Tolerance: ±1%; Part Number: R0805_330K_1%_0.125W_100PPM; Component Kind: Standard; Component Type: Standard; Pin Count: 2; Value: 330k; Status: Preferred; Case: 0805; Mounted: Yes; Sense: No; Socket: No; SMD: Yes; Manufacturer1 Example: NIC COMPONENT; Manufacturer1 ComponentHeight: 0.6mm; HelpURL: \\cern.ch\dfs\Applications\Altium\Datasheets\R0805_NIC_NRC.pdf; Author: CERN DEM JLC; CreateDate: 03/12/2007; LatestRevisionDate: 13/03/2008
R31 R32 = R0603_100R_1%_0.1W_100PPM: Resistor - 1%; Part Description: General Purpose Thick Film Chip Resistor; Manufacturer: GENERIC; Manufacturer1 Part Number: NRC06F1000TRF; Power: 0.1W; TC: ±100ppm/°C; Part Number: R0603_100R_1%_0.1W_100PPM; Component Kind: Standard; Component Type: Standard; Pin Count: 2; Value: 100; Status: Preferred; Tolerance: ±1%; Manufacturer Part Number: R0603_100R_1%_0.1W_100PPM; Case: 0603; Mounted: Yes; Sense: No; Socket: No; SMD: Yes; Manufacturer1 Example: NIC COMPONENT; Manufacturer1 ComponentHeight: 0.55mm; HelpURL: \\cern.ch\dfs\Applications\Altium\Datasheets\R0603_NIC_NRC.pdf; Author: CERN DEM JLC; CreateDate: 03/12/2007; LatestRevisionDate: 13/03/2008
T18 = PMGD280UN: Dual N-Channel micro TrenchMOS™ Ultra Low Level FET; Part Description: 20V 870mA Dual N-Channel micro TrenchMOS™ Ultra Low Level FET; Manufacturer: NXP SEMICONDUCTORS; PressFit: No; Bonding: No; Part Number: PMGD280UN; Component Kind: Standard; Component Type: Standard; Device: PMGD280UN; PackageDescription: SOT363, SC70-6, SOT, 0.65mm Pitch, 6 pin, 1.25mm W X 2.00mm L X 1.10mm H, IPC Medium Density; Manufacturer Part Number: PMGD280UN; Pin Count: 6; Case: SOT363; Mounted: Yes; Socket: No; SMD: Yes; Sense: No; ComponentHeight: 1.1mm; HelpURL: \\cern.ch\dfs\Applications\Altium\Datasheets\PMGD280UN.pdf; Author: CERN DEM JLC; CreateDate: 19/11/2014; LatestRevisionDate: 19/11/2014